# EAGLE design rear_light_connect (EAGLE 8.3.1)
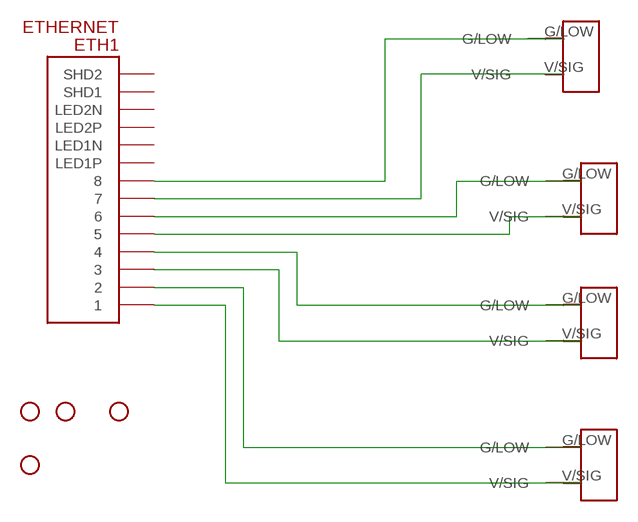
[diagram p0: schematic, sheet 1]

## Parts
ETH1  ETHERNET  [A122645-ND]
H1  STAND-OFF  [STAND-OFF]
H2  STAND-OFF  [STAND-OFF]
H3  STAND-OFF  [STAND-OFF]
H4  STAND-OFF  [STAND-OFF]
L_DRIVE  2_PIN_TECONNECTOR  [2_PIN_CONNECT]
L_SIG  2_PIN_TECONNECTOR  [2_PIN_CONNECT]
R-DRIVE  2_PIN_TECONNECTOR  [2_PIN_CONNECT]
R_SIG  2_PIN_TECONNECTOR  [2_PIN_CONNECT]

## Nets
N$1: ETH1.P$1 R-DRIVE.V/SIG
N$2: ETH1.P$2 R-DRIVE.G/LOW
N$3: ETH1.P$3 L_DRIVE.V/SIG
N$4: ETH1.P$4 L_DRIVE.G/LOW
N$5: ETH1.P$5 R_SIG.V/SIG
N$6: ETH1.P$6 R_SIG.G/LOW
N$7: ETH1.P$7 L_SIG.V/SIG
N$8: ETH1.P$8 L_SIG.G/LOW
Unconnected: ETH1.P$9(LED1N) ETH1.P$10(LED1P) ETH1.P$11(LED2N) ETH1.P$12(LED2P) ETH1.P$13(SHD1) ETH1.P$14(SHD2)

## Library data of the parts
ETH1 = ETHERNET:ETHERNET: Ethernet port with 2 leds. digikey number A122645-ND
H1-H4 = SparkFun-Electromechanical:STAND-OFF: #4 Stand Off This is the mechanical footprint for a #4 phillips button head screw. Use the keepout ring to avoid running the screw head into surrounding components. SKU : PRT-00447
L_DRIVE L_SIG R-DRIVE R_SIG = TE 2-pin connector:2_PIN_TECONNECTOR: 2-pin connector for high power connections on board

## Board
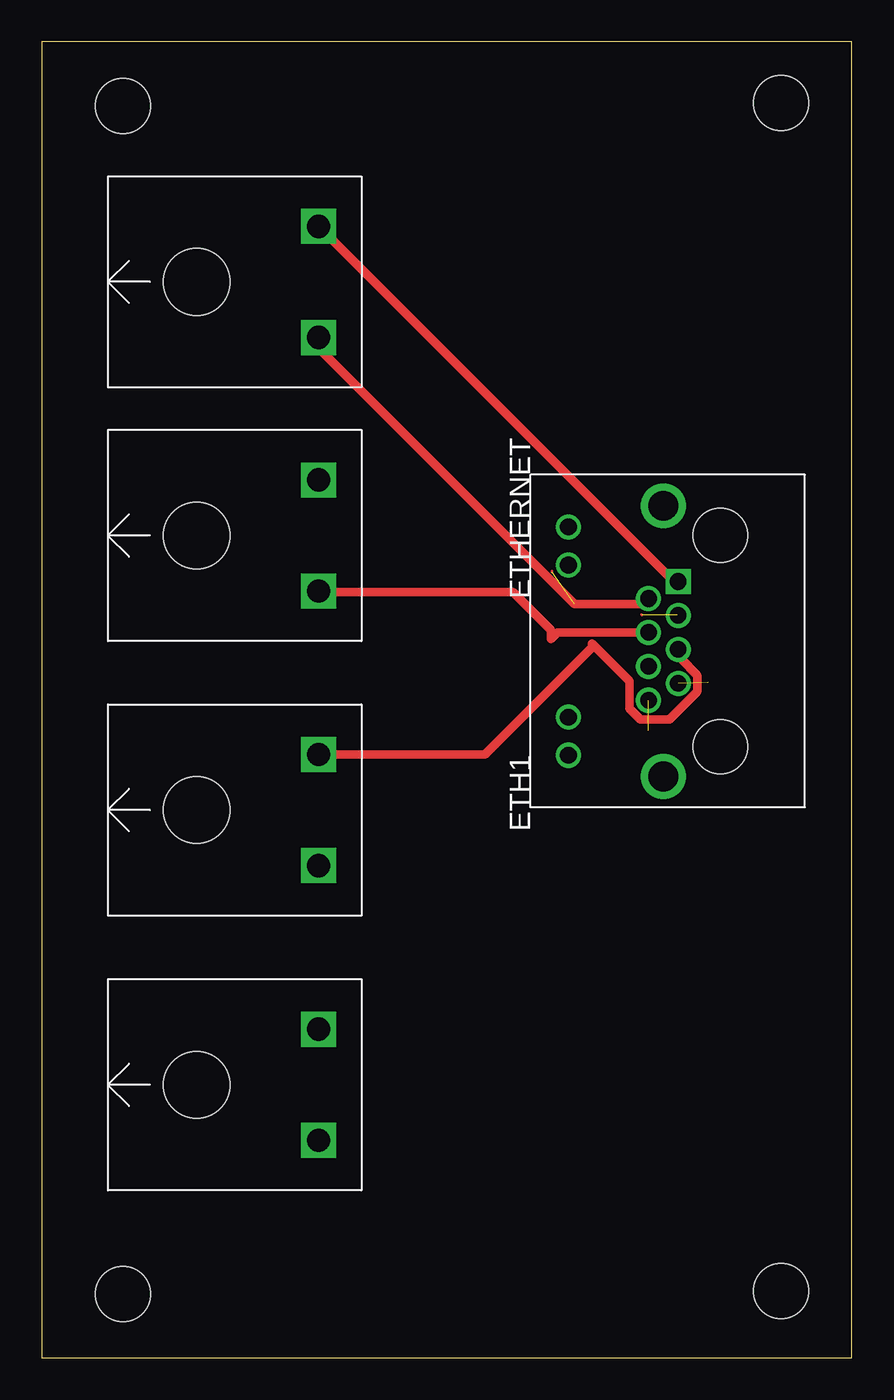
[diagram p1: board, top side]
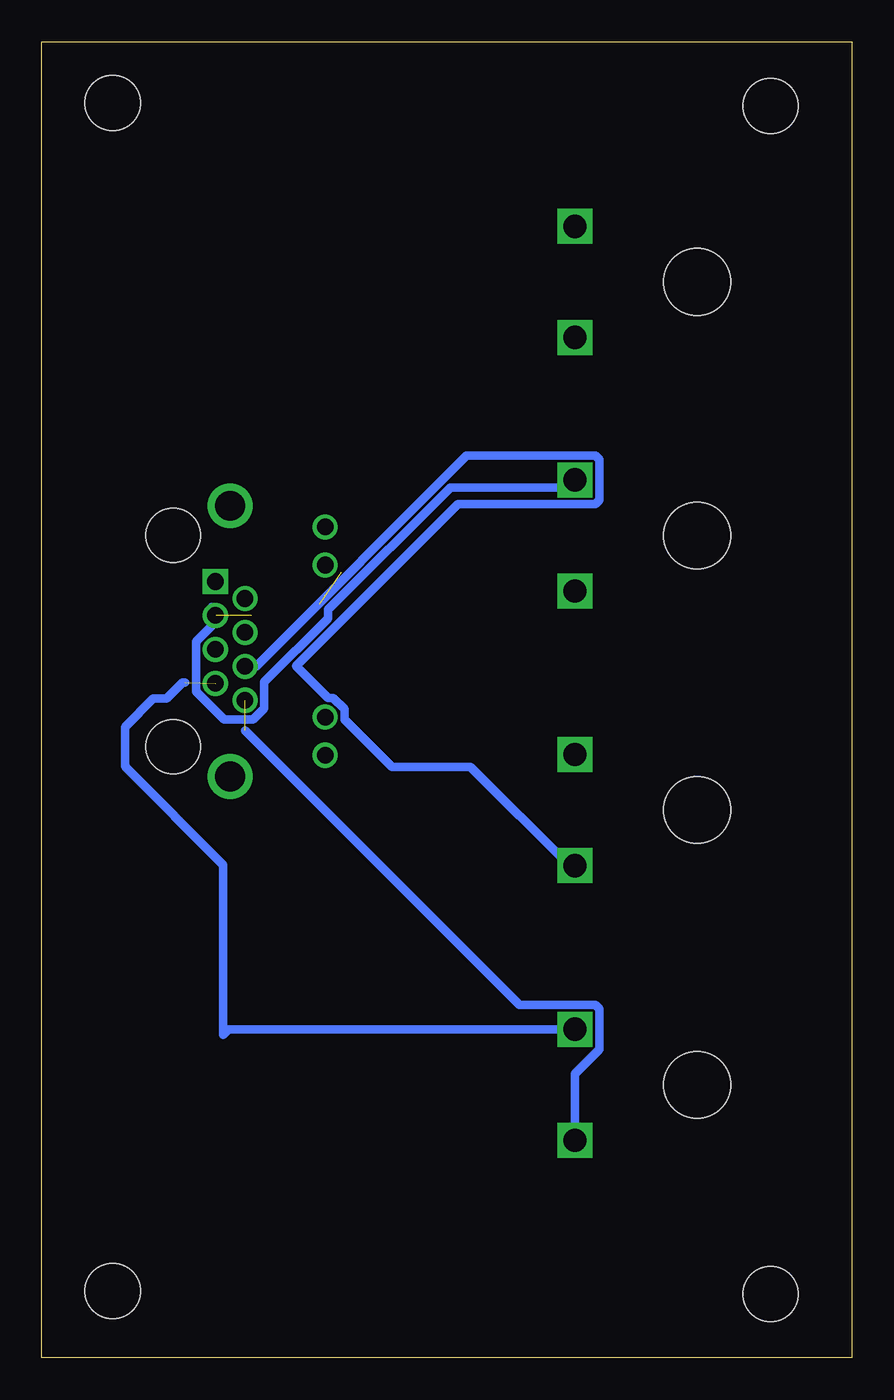
[diagram p2: board, bottom side, seen from below]

Size 48.72 x 79.12 mm. Coordinates in mm from the lower left corner, seen from the top.
Outline: 0,0 48.72,0 48.72,79.12 0,79.12 0,0
Copper layers (1*16): Top 0.035mm / dielectric 1.5mm / Bottom 0.035mm
Design rules "default": minimum track width 6mil, minimum drill 0.35mm, track to track 6mil, track to pad 6mil, pad to pad 6mil, via to via 6mil, smd to smd 6mil, copper to edge 40mil, drill to drill 6mil, minimum pad ring 10mil, minimum via ring 8mil, stop-mask expansion 4mil, vias tented up to drill 0mil, thermal gap 10mil

### Footprints (pad centres in the part's own frame; a part is rotated, then mirrored left to right if it is on the bottom)
A122645-ND = drill 1 square: P$1 3.58,2.54 | drill 1: P$2 2.56,4.32; P$3 1.54,2.54; P$4 0.52,4.32; P$5 -0.5,2.54; P$6 -1.52,4.32; P$7 -2.54,2.54; P$8 -3.56,4.32; P$9 -6.86,9.14; P$10 -4.57,9.14; P$11 4.57,9.14; P$12 6.86,9.14 | drill 1.8: P$13 -8.13,3.43; P$14 8.13,3.43 | hole 3.25: -6.35,0; 6.35,0
STAND-OFF = hole 3.302: 0,0
2_PIN_CONNECT = drill 1.4 square: G/LOW 3.34,12.67; V/SIG -3.34,12.67 | hole 4: 0,5.33

### Placement (x,y rotation side)
ETH1  40.81,43.09 90 top
H1  4.9,3.85 0 top
H2  44.45,4.03 0 top
H3  4.9,75.25 0 top
H4  44.45,75.42 0 top
L_DRIVE  3.98,49.44 270 top
L_SIG  3.98,16.42 270 top
R-DRIVE  3.98,64.68 270 top
R_SIG  3.98,32.93 270 top

### Tracks (layer width: path | path; a pad name or v marks a point on that pad's centre or on a via)
N$1
  Top 0.152: ETH1.P$1 38,46.67
  Top 0.508: R-DRIVE.V/SIG 38,46.67 ETH1.P$1
N$2  (1 unrouted)
  Top 0.152: 30.69,47.3 30.69,47.25
  Top 0.508: R-DRIVE.G/LOW 16.66,60.7 32.02,45.33 36.17,45.33 ETH1.P$2
N$3  (1 unrouted)
  Top 0.152: 36.05,44.7 36.09,44.67 | 38.24,44.67 ETH1.P$3
  Bottom 0.508: L_DRIVE.V/SIG 17.11,52.33 24.15,52.33 31.5,44.98 31.5,44.45 35.33,40.62 35.33,39.05 36.01,38.37 37.74,38.37 39.43,40.07 39.43,43.07 38.5,44.01 38.5,45.15 38.27,44.93 ETH1.P$3
N$4
  Top 0.508: L_DRIVE.G/LOW 16.73,46.03 28.35,46.03 30.62,43.75 30.62,43.23 31.01,43.61 ETH1.P$4
N$5
  Top 0.152: 38.42,42.58 38.8,42.2 38.66,42.2 ETH1.P$5
  Top 0.508: R_SIG.V/SIG 26.64,36.27 33.07,42.7 33.07,42.95 35.33,40.69 35.33,39.05 36.01,38.37 37.74,38.37 39.43,40.07 39.43,41.03 38.42,42.04 38.42,42.58
N$6
  Top 0.152: ETH1.P$6
  Bottom 0.508: R_SIG.G/LOW 16.99,29.59 22.93,35.53 27.65,35.53 30.52,38.39 30.52,39 31.19,39.68 31.51,39.68 33.42,41.59 23.69,51.32 15.44,51.32 15.2,51.56 15.2,54 15.44,54.24 23.17,54.24 35.84,41.57 ETH1.P$6
N$7  (1 unrouted)
  Bottom 0.508: L_SIG.V/SIG 37.46,19.76 37.8,19.43 37.8,29.63 43.71,35.54 43.71,37.94 42.01,39.64 41.21,39.64 40.25,40.6 40.1,40.6
N$8  (1 unrouted)
  Bottom 0.508: 36.49,37.71 20,21.22 15.44,21.22 15.2,20.98 15.2,18.54 16.66,17.09 L_SIG.G/LOW